# Altium project CanSat1_PCB.PrjPcb
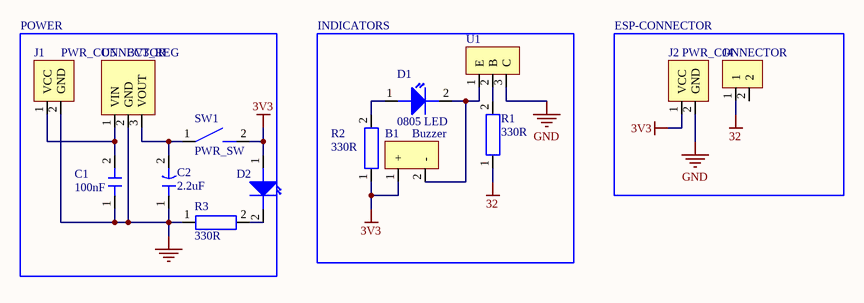
[diagram p0: CanSat1_Sch.SchDoc]
5 sheets, 45 parts. Net scope: global (net labels, ports and power ports of the same name join across sheets).
Board files: PCB1.PcbDoc, SENSORS.PcbDoc, MICROCONTROLLER.PcbDoc, LoRa.PcbDoc, Panel.PcbDoc, Huitzil2.PcbDoc
Sheets:
  CanSat1_Sch.SchDoc
  SENSORS.SchDoc
  MICROCONTROLLER.SchDoc
  LoRa.SchDoc
  Huitzil2.SchDoc

## Sheet CanSat1_Sch.SchDoc
size A4

### Parts
B1  Buzzer  [BUZZER]
C1  100nF  [CERAMIC CAP]
C2  2.2uF  [Electrolytic capacitor 2mm]
D1  0805 LED  [3mm_LED]
D2  0805 LED  [3mm_LED]  (value not drawn)
J1  PWR_CONNECTOR  [BATT]
J2  PWR_CONNECTOR  [BATT]
J4  2x1_CONN  [CONN2x1_2.54mm]  (value not drawn)
R1  330R  [THT RESISTOR]
R2  330R  [THT RESISTOR]
R3  330R  [THT RESISTOR]
SW1  PWR_SW  [PWR-SW]
U1  NPN Transistor  [2N2222A]  (value not drawn)
U5  3V3_REG  [LF33CV]

### Blocks framed on the sheet
POWER: C1 C2 D2 J1 R3 SW1 U5
INDICATORS: B1 D1 R1 R2 U1
ESP-CONNECTOR: J2 J4

### Nets
3V3: B1.1(+) D2.1(A) J2.1(VCC) R2.1 SW1.2(+)
32: J4.1 R1.1
GND: C1.1(+) C2.1(+) J1.2(GND) J2.2(GND) R3.1 U1.3(C) U5.2(GND)
NetB1_2: B1.2(-) D1.2(K) U1.1(E)
NetC1_2: C1.2(-) J1.1(VCC) U5.1(VIN)
NetC2_2: C2.2(-) SW1.1(+) U5.3(VOUT)
NetD1_1: D1.1(A) R2.2
NetD2_2: D2.2(K) R3.2
NetR1_2: R1.2 U1.2(B)

Not connected (* = marked no-connect by the designer): J4 2

### Library data of the parts
B1 = BUZZER: Active buzzer
C1 = CAP: Ceramic through-hole capacitor
C2 = E_CAP_2.2uF: Throug-hole 2.2uF
D1 D2 = LED: Through-hole LED
J1 J2 = PWR-CONN: THT Connector
J4 = CONN 2x1: THT 2x1 2.54mm CONN
R1-R3 = Resistor: Through-hole resistor
SW1 = SWITCH: Mechanical through-hole switch
U1 = 2N2222: Through-hole NPN Transistor
U5 = LF33CV: Through-hole 3.3V regulator

## Sheet SENSORS.SchDoc
size A4
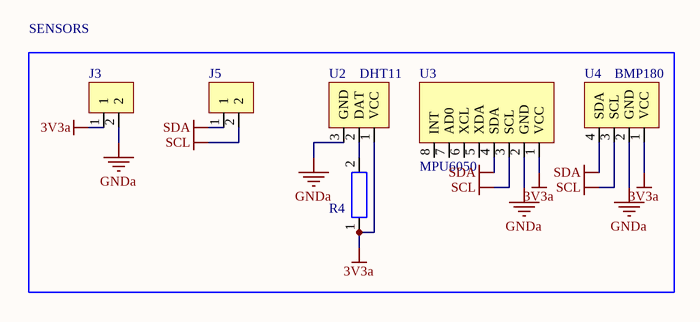
[diagram p1: SENSORS.SchDoc]

### Parts
J3  2x1_CONN  [CONN2x1_2.54mm]  (value not drawn)
J5  2x1_CONN  [CONN2x1_2.54mm]  (value not drawn)
R4  330R  [THT RESISTOR]  (value not drawn)
U2  DHT11  [DHT11]
U3  MPU6050  [MPU6050]
U4  BMP180  [BMP180]

### Blocks framed on the sheet
SENSORS: J3 J5 R4 U2-U4

### Nets
3V3a: J3.1 R4.1 U2.1(VCC) U3.1(VCC) U4.1(VCC)
GNDa: J3.2 U2.3(GND) U3.2(GND) U4.2(GND)
SCL: J5.2 U3.3(SCL) U4.3(SCL)
SDA: J5.1 U3.4(SDA) U4.4(SDA)
NetR4_2: R4.2 U2.2(DAT)

Not connected (* = marked no-connect by the designer): U3 5(XDA) 6(XCL) 7(AD0) 8(INT)

### Library data of the parts
J3 J5 = CONN 2x1: THT 2x1 2.54mm CONN
R4 = Resistor: Through-hole resistor
U2 = DHT11: Humidity and temperature sensor
U3 = MPU6050: 6DOF IMU sensor
U4 = BMP180: Bosch Pressure Sensor

## Sheet MICROCONTROLLER.SchDoc
size A4
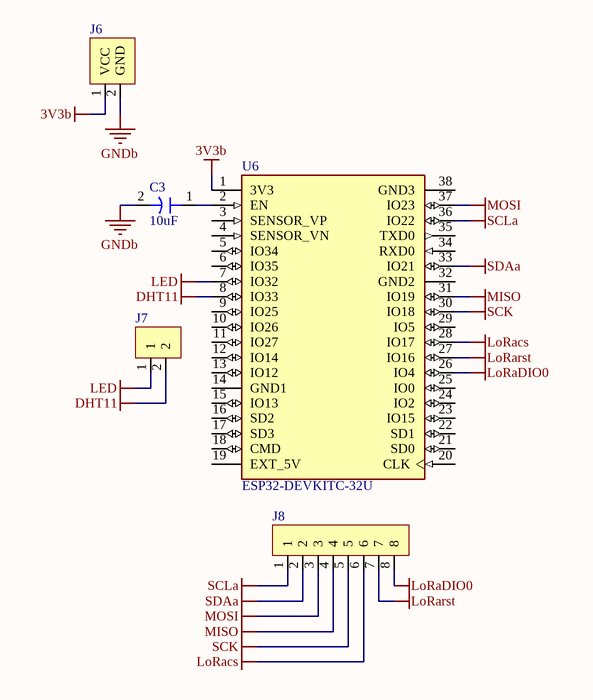
[diagram p2: MICROCONTROLLER.SchDoc]

### Parts
C3  10uF  [Electrolytic capacitor 2mm]
J6  PWR_CONNECTOR  [BATT]  (value not drawn)
J7  2x1_CONN  [CONN2x1_2.54mm]  (value not drawn)
J8  8x1 CONN  [CONN8x1_2.54]  (value not drawn)
U6  ESP32-DEVKITC-32U  [MODULE_ESP32-DEVKITC-32U]

### Nets
3V3b: J6.1(VCC) U6.1(3V3)
DHT11: J7.2 U6.8(IO33)
GNDb: C3.2(-) J6.2(GND)
LED: J7.1 U6.7(IO32)
LoRacs: J8.6 U6.28(IO17)
LoRaDIO0: J8.8 U6.26(IO4)
LoRarst: J8.7 U6.27(IO16)
MISO: J8.4 U6.31(IO19)
MOSI: J8.3 U6.37(IO23)
SCK: J8.5 U6.30(IO18)
SCLa: J8.1 U6.36(IO22)
SDAa: J8.2 U6.33(IO21)
NetC3_1: C3.1(+) U6.2(EN)

Not connected (* = marked no-connect by the designer): U6 3(SENSOR_VP) 4(SENSOR_VN) 5(IO34) 6(IO35) 9(IO25) 10(IO26) 11(IO27) 12(IO14) 13(IO12) 14(GND1) 15(IO13) 16(SD2) 17(SD3) 18(CMD) 19(EXT_5V) 20(CLK) 21(SD0) 22(SD1) 23(IO15) 24(IO2) 25(IO0) 29(IO5) 32(GND2) 34(RXD0) 35(TXD0) 38(GND3)

### Library data of the parts
C3 = E_CAP_10uF: Throug-hole 10uF
J6 = PWR-CONN: THT Connector
J7 = CONN 2x1: THT 2x1 2.54mm CONN
J8 = CONN 8x1: THT 8x1 2.54mm CONN
U6 = ESP32-DEVKITC-32U: ESP32-WROOM-32UE series Transceiver; 802.11 b/g/n (Wi-Fi, WiFi, WLAN), BluetoothÂ® Smart Ready 4.x Dual Mode Evaluation Board; MF: Espressif Systems; SnapEDA_Link: https://www.snapeda.com/parts/ESP32-DEVKITC-32U/Espressif+Systems/view-part/?ref=snap; Availability: In Stock; Purchase-URL: https://pricing.snapeda.com/search/part/ESP32-DEVKITC-32U/?ref=eda; Check_prices: https://www.snapeda.com/parts/ESP32-DEVKITC-32U/Espressif+Systems/view-part/?ref=eda; Value: *; Package: None; MP: ESP32-DEVKITC-32U; Price: None

## Sheet LoRa.SchDoc
size A4
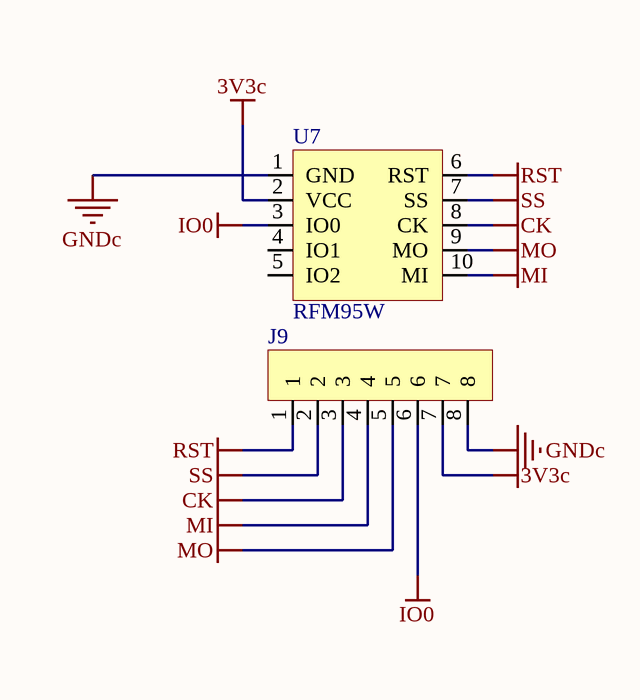
[diagram p3: LoRa.SchDoc]

### Parts
J9  8x1 CONN  [CONN8x1_2.54]  (value not drawn)
U7  RFM95W  [Bluee LoRa]

### Nets
3V3c: J9.7 U7.2(VCC)
CK: J9.3 U7.8(CK)
GNDc: J9.8 U7.1(GND)
IO0: J9.6 U7.3(IO0)
MI: J9.4 U7.10(MI)
MO: J9.5 U7.9(MO)
RST: J9.1 U7.6(RST)
SS: J9.2 U7.7(SS)

Not connected (* = marked no-connect by the designer): U7 4(IO1) 5(IO2)

### Library data of the parts
J9 = CONN 8x1: THT 8x1 2.54mm CONN
U7 = RMF95W: 915 MHz LoRa Transceiver

## Sheet Huitzil2.SchDoc
size A4
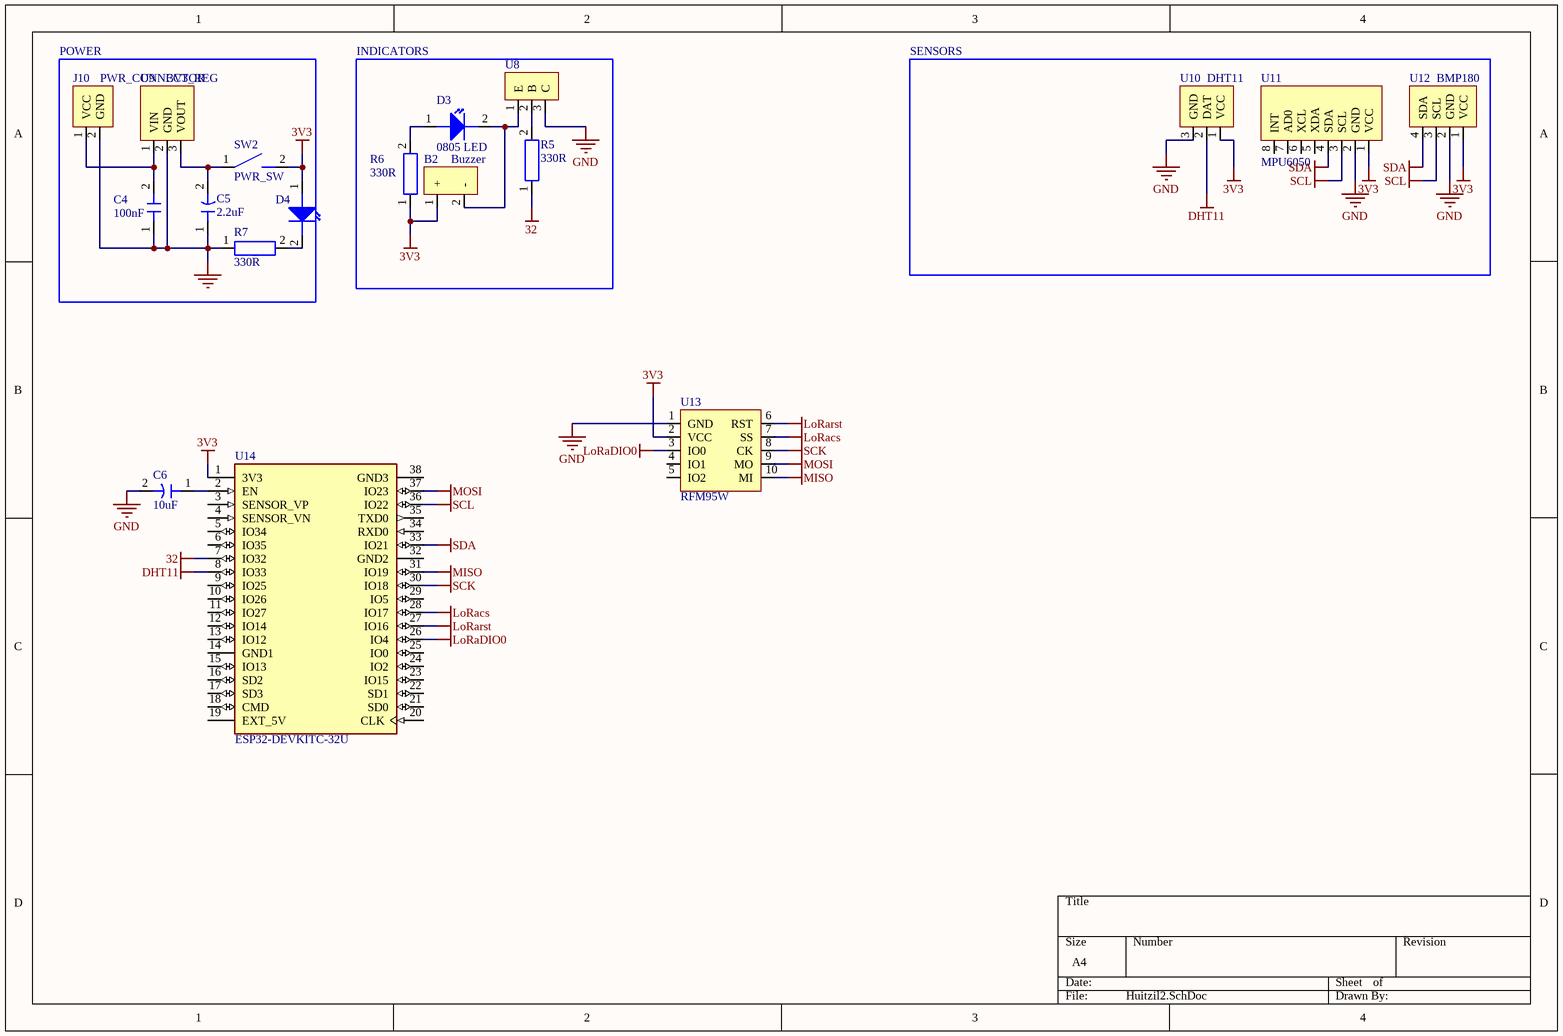
[diagram p4: Huitzil2.SchDoc]

### Parts
B2  Buzzer  [BUZZER]
C4  100nF  [CERAMIC CAP]
C5  2.2uF  [Electrolytic capacitor 2mm]
C6  10uF  [Electrolytic capacitor 2mm]
D3  0805 LED  [3mm_LED]
D4  0805 LED  [3mm_LED]  (value not drawn)
J10  PWR_CONNECTOR  [BATT]
R5  330R  [THT RESISTOR]
R6  330R  [THT RESISTOR]
R7  330R  [THT RESISTOR]
SW2  PWR_SW  [PWR-SW]
U8  NPN Transistor  [2N2222A]  (value not drawn)
U9  3V3_REG  [LF33CV]
U10  DHT11  [DHT11]
U11  MPU6050  [MPU6050]
U12  BMP180  [BMP180]
U13  RFM95W  [Bluee LoRa]
U14  ESP32-DEVKITC-32U  [MODULE_ESP32-DEVKITC-32U]

### Blocks framed on the sheet
POWER: C4 C5 D4 J10 R7 SW2 U9
INDICATORS: B2 D3 R5 R6 U8
SENSORS: U10-U12

### Nets
3V3: B2.1(+) D4.1(A) R6.1 SW2.2(+) U10.1(VCC) U11.1(VCC) U12.1(VCC) U13.2(VCC) U14.1(3V3)
32: R5.1 U14.7(IO32)
DHT11: U10.2(DAT) U14.8(IO33)
GND: C4.1(+) C5.1(+) C6.2(-) J10.2(GND) R7.1 U8.3(C) U9.2(GND) U10.3(GND) U11.2(GND) U12.2(GND) U13.1(GND)
LoRacs: U13.7(SS) U14.28(IO17)
LoRaDIO0: U13.3(IO0) U14.26(IO4)
LoRarst: U13.6(RST) U14.27(IO16)
MISO: U13.10(MI) U14.31(IO19)
MOSI: U13.9(MO) U14.37(IO23)
SCK: U13.8(CK) U14.30(IO18)
SCL: U11.3(SCL) U12.3(SCL) U14.36(IO22)
SDA: U11.4(SDA) U12.4(SDA) U14.33(IO21)
NetB2_2: B2.2(-) D3.2(K) U8.1(E)
NetC4_2: C4.2(-) J10.1(VCC) U9.1(VIN)
NetC5_2: C5.2(-) SW2.1(+) U9.3(VOUT)
NetC6_1: C6.1(+) U14.2(EN)
NetD3_1: D3.1(A) R6.2
NetD4_2: D4.2(K) R7.2
NetR5_2: R5.2 U8.2(B)

Not connected (* = marked no-connect by the designer): U11 5(XDA) 6(XCL) 7(AD0) 8(INT); U13 4(IO1) 5(IO2); U14 3(SENSOR_VP) 4(SENSOR_VN) 5(IO34) 6(IO35) 9(IO25) 10(IO26) 11(IO27) 12(IO14) 13(IO12) 14(GND1) 15(IO13) 16(SD2) 17(SD3) 18(CMD) 19(EXT_5V) 20(CLK) 21(SD0) 22(SD1) 23(IO15) 24(IO2) 25(IO0) 29(IO5) 32(GND2) 34(RXD0) 35(TXD0) 38(GND3)

### Library data of the parts
B2 = BUZZER: Active buzzer
C4 = CAP: Ceramic through-hole capacitor
C5 = E_CAP_2.2uF: Throug-hole 2.2uF
C6 = E_CAP_10uF: Throug-hole 10uF
D3 D4 = LED: Through-hole LED
J10 = PWR-CONN: THT Connector
R5-R7 = Resistor: Through-hole resistor
SW2 = SWITCH: Mechanical through-hole switch
U8 = 2N2222: Through-hole NPN Transistor
U9 = LF33CV: Through-hole 3.3V regulator
U10 = DHT11: Humidity and temperature sensor
U11 = MPU6050: 6DOF IMU sensor
U12 = BMP180: Bosch Pressure Sensor
U13 = RMF95W: 915 MHz LoRa Transceiver
U14 = ESP32-DEVKITC-32U: as U6 on sheet MICROCONTROLLER; SnapEDA_Link: https://www.snapeda.com/parts/ESP32-DEVKITC-32U/Espressif+Systems/view-part/?ref=snap; Availability: In Stock; Purchase-URL: https://pricing.snapeda.com/search/part/ESP32-DEVKITC-32U/?ref=eda; Check_prices: https://www.snapeda.com/parts/ESP32-DEVKITC-32U/Espressif+Systems/view-part/?ref=eda; Value: *; Package: None; MP: ESP32-DEVKITC-32U; Price: None

## Nets that join several sheets
3V3: CanSat1_Sch (5 pins), Huitzil2 (9 pins)
32: CanSat1_Sch (J4.1 R1.1), Huitzil2 (R5.1 U14.7)
DHT11: MICROCONTROLLER (J7.2 U6.8), Huitzil2 (U10.2 U14.8)
GND: CanSat1_Sch (7 pins), Huitzil2 (11 pins)
LoRacs: MICROCONTROLLER (J8.6 U6.28), Huitzil2 (U13.7 U14.28)
LoRaDIO0: MICROCONTROLLER (J8.8 U6.26), Huitzil2 (U13.3 U14.26)
LoRarst: MICROCONTROLLER (J8.7 U6.27), Huitzil2 (U13.6 U14.27)
MISO: MICROCONTROLLER (J8.4 U6.31), Huitzil2 (U13.10 U14.31)
MOSI: MICROCONTROLLER (J8.3 U6.37), Huitzil2 (U13.9 U14.37)
SCK: MICROCONTROLLER (J8.5 U6.30), Huitzil2 (U13.8 U14.30)
SCL: SENSORS (J5.2 U3.3 U4.3), Huitzil2 (U11.3 U12.3 U14.36)
SDA: SENSORS (J5.1 U3.4 U4.4), Huitzil2 (U11.4 U12.4 U14.33)